# EAGLE design cwKeyer (EAGLE 6.6.0)

## Sheet 1 of 2
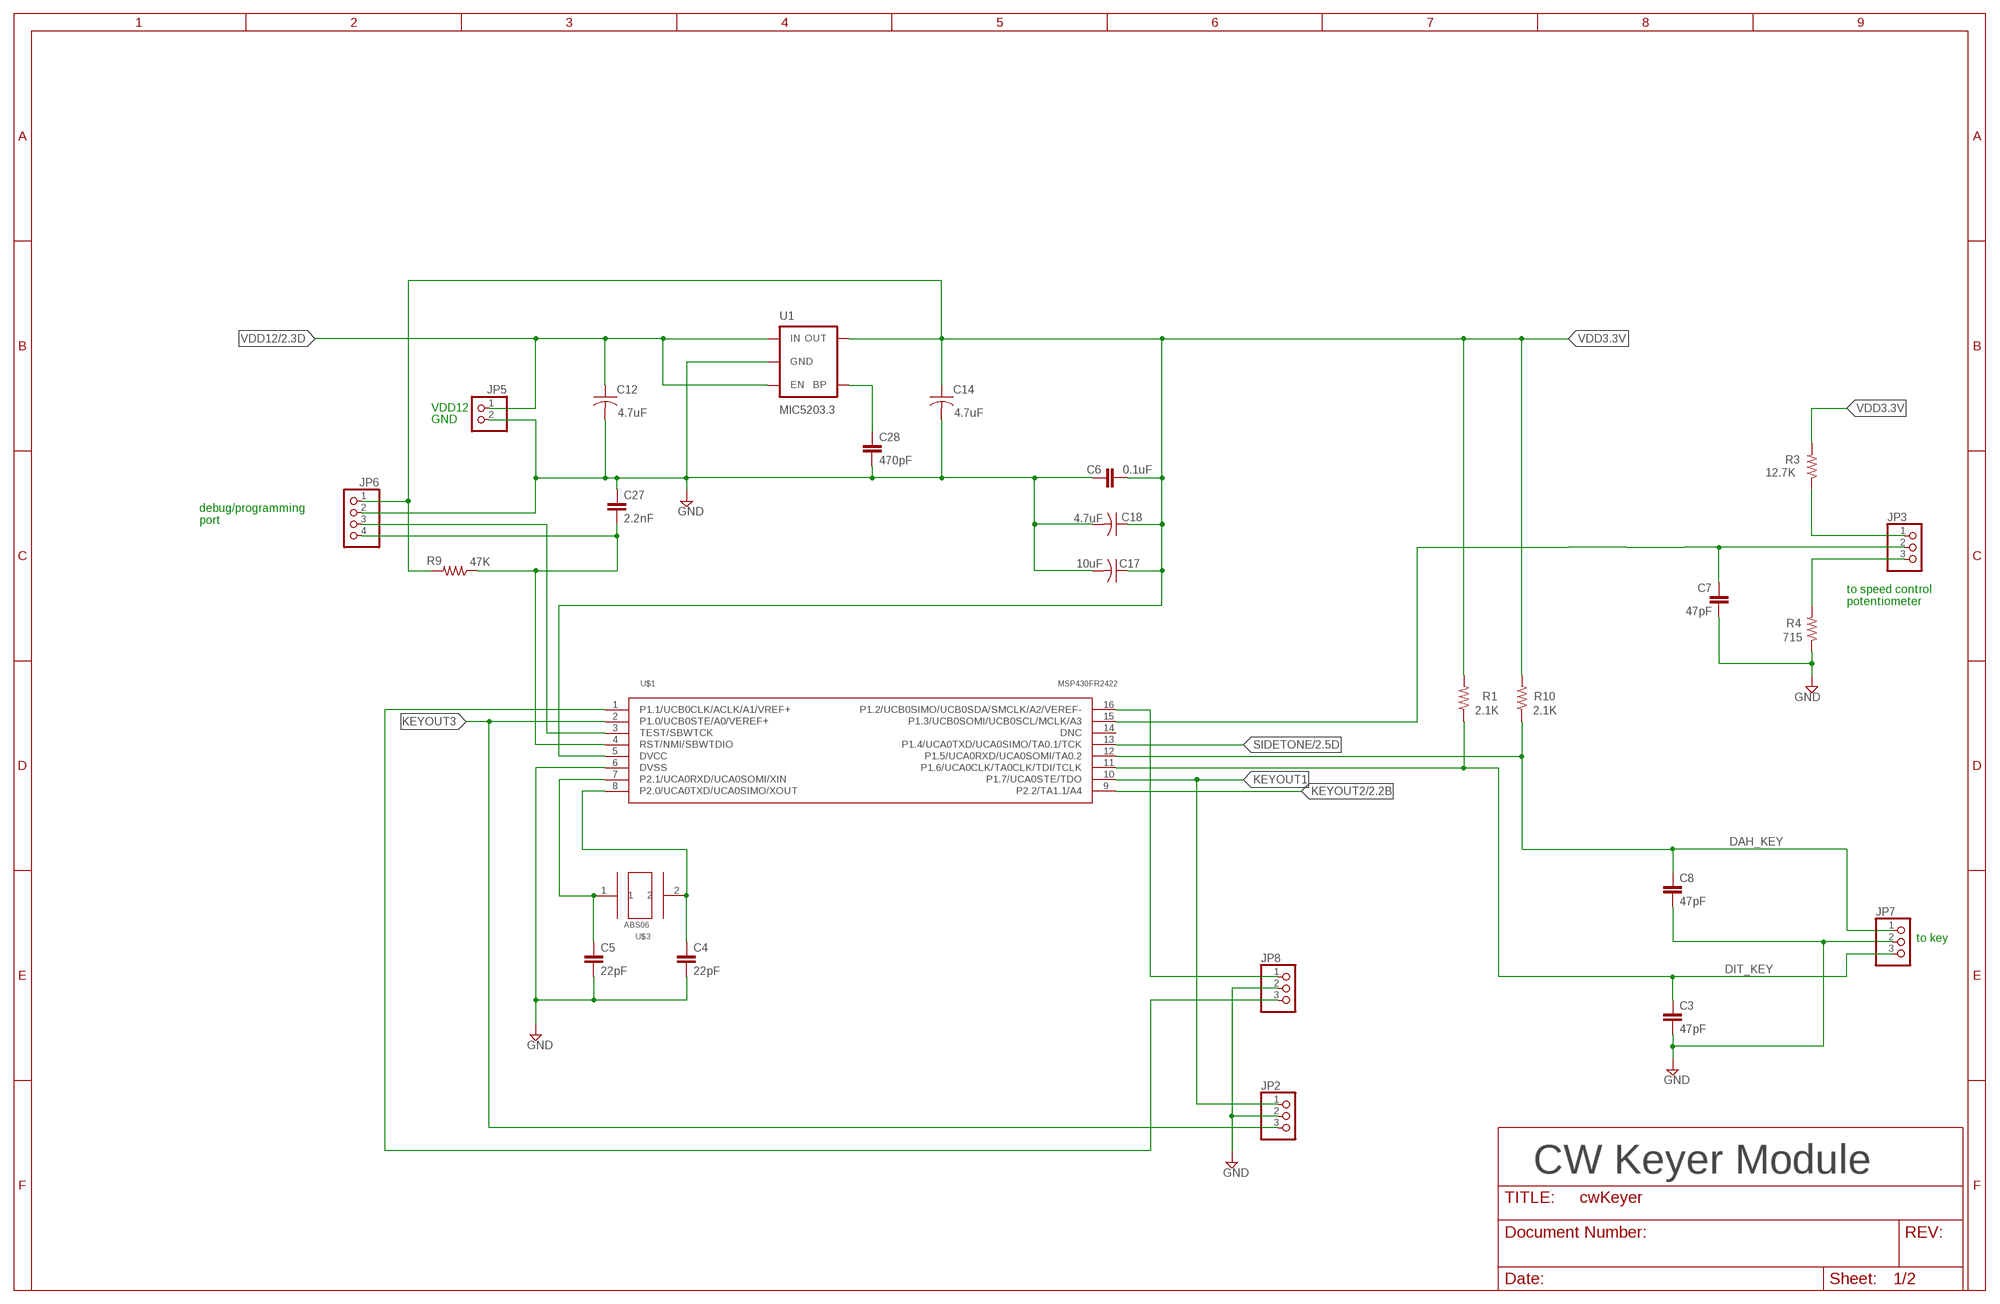
[diagram p0: schematic, sheet 1]

### Parts
C3  47pF  CAP0603-CAP  [0603-CAP]
C4  22pF  CAP0603-CAP  [0603-CAP]
C5  22pF  CAP0603-CAP  [0603-CAP]
C6  0.1uF  CAP0603-CAP  [0603-CAP]
C7  47pF  CAP0603-CAP  [0603-CAP]
C8  47pF  CAP0603-CAP  [0603-CAP]
C12  4.7uF  C-USC0603  [C0603]
C14  4.7uF  C-USC0603  [C0603]
C17  10uF  C-USC0805  [C0805]
C18  4.7uF  C-USC0603  [C0603]
C27  2.2nF  CAP0603-CAP  [0603-CAP]
C28  470pF  CAP0603-CAP  [0603-CAP]
JP2  PINHD-1X3  [1X03]
JP3  PINHD-1X3  [1X03]
JP5  PINHD-1X2  [1X02]
JP6  PINHD-1X4  [1X04]
JP7  PINHD-1X3  [1X03]
JP8  PINHD-1X3  [1X03]
R1  2.1K  RESISTOR0603-RES  [0603-RES]
R3  12.7K  RESISTOR0603-RES  [0603-RES]
R4  715  RESISTOR0603-RES  [0603-RES]
R9  47K  RESISTOR0603-RES  [0603-RES]
R10  2.1K  RESISTOR0603-RES  [0603-RES]
U1  MIC5203.3  MIC52053.3V  [SOT23-5]
U$1  MSP430FR2422  [TSSOP16]
U$3  ABS06  [ABS06]

### Nets
DAH_KEY: C8.1 JP7.1 R10.1 U$1.12(P1.5/UCA0RXD/UCA0SOMI/TA0.2)
DIT_KEY: C3.1 JP7.3 R1.1 U$1.11(P1.6/UCA0CLK/TA0CLK/TDI/TCLK)
GND: C3.2 C4.2 C5.2 C6.2 C7.2 C8.2 C12.2 C14.2 C17.2 C18.2 C27.1 C28.2 JP2.2 JP5.2 JP6.2 JP7.2 JP8.2 R4.1 U1.2(GND) U$1.6(DVSS) ; also sheet 2
KEYOUT1: JP2.1 U$1.10(P1.7/UCA0STE/TDO)
KEYOUT2: U$1.9(P2.2/TA1.1/A4) ; also sheet 2
KEYOUT3: JP2.3 U$1.2(P1.0/UCB0STE/A0/VEREF+)
N$2: C7.1 JP3.2 U$1.15(P1.3/UCB0SOMI/UCB0SCL/MCLK/A3)
N$5: C4.1 U$1.8(P2.0/UCA0TXD/UCA0SIMO/XOUT) U$3.2
N$8: JP3.3 R4.2
N$9: JP3.1 R3.1
N$14: C28.1 U1.4(BP)
N$23: JP6.3 U$1.3(TEST/SBWTCK)
N$31: C27.2 JP6.4 R9.1 U$1.4(RST/NMI/SBWTDIO)
N$32: C5.1 U$1.7(P2.1/UCA0RXD/UCA0SOMI/XIN) U$3.1
N$34: JP8.1 U$1.16(P1.2/UCB0SIMO/UCB0SDA/SMCLK/A2/VEREF-)
N$35: JP8.3 U$1.1(P1.1/UCB0CLK/ACLK/A1/VREF+)
SIDETONE: U$1.13(P1.4/UCA0TXD/UCA0SIMO/TA0.1/TCK) ; also sheet 2
VDD3.3V: C6.1 C14.1 C17.1 C18.1 JP6.1 R1.2 R3.2 R9.2 R10.2 U1.5(OUT) U$1.5(DVCC)
VDD12: C12.1 JP5.1 U1.1(IN) U1.3(EN) ; also sheet 2
Unconnected: U$1.14(DNC)

### Notes on the sheet
- VDD12
- GND
- debug/programming
  port
- to speed control
  potentiometer
- to key
- CW Keyer Module

## Sheet 2 of 2
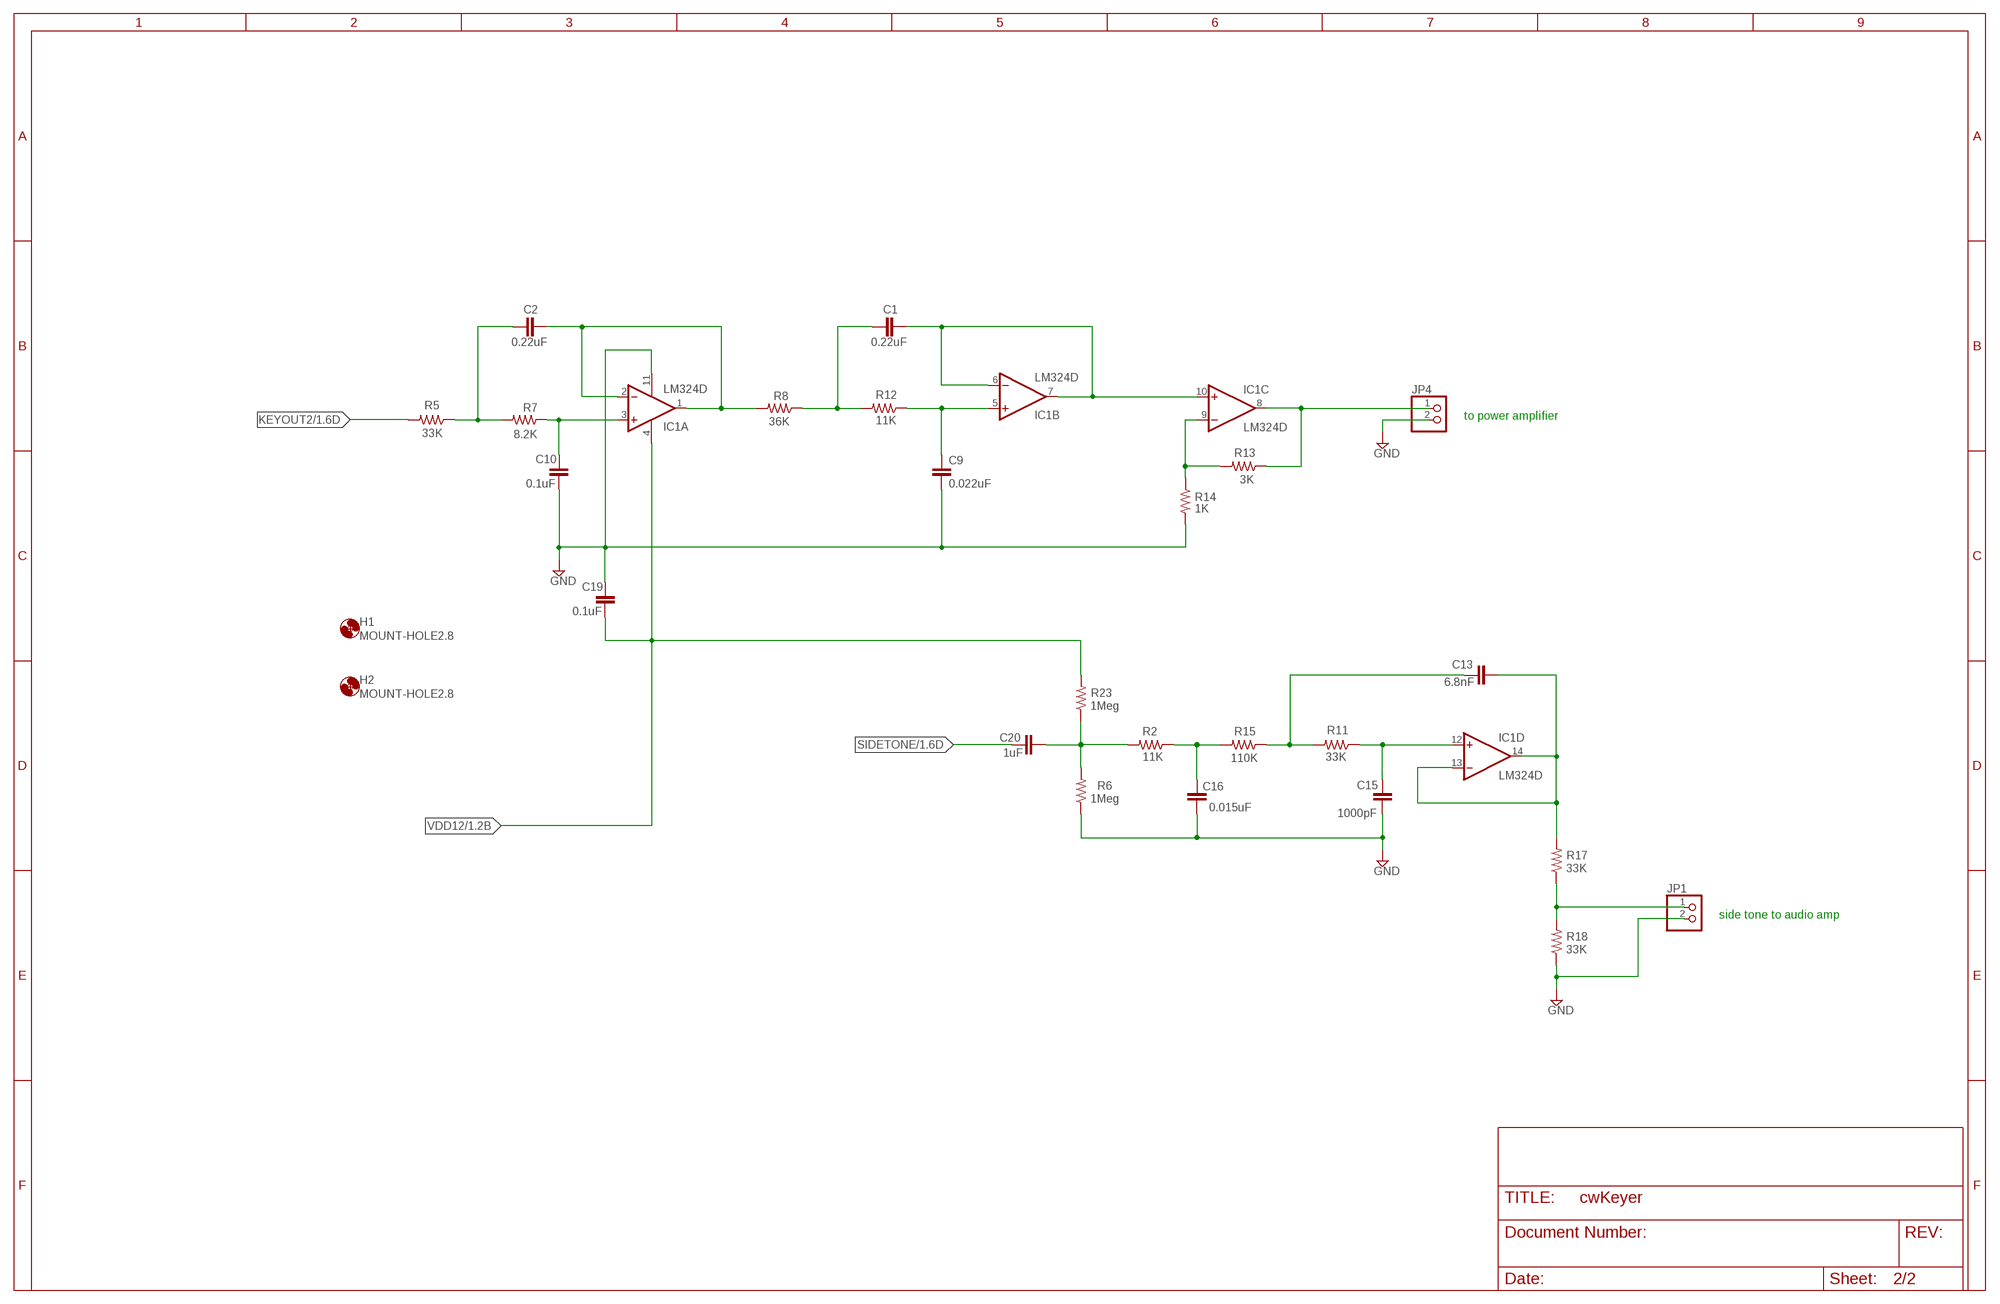
[diagram p1: schematic, sheet 2]

### Parts
C1  0.22uF  CAP0603-CAP  [0603-CAP]
C2  0.22uF  CAP0603-CAP  [0603-CAP]
C9  0.022uF  CAP0603-CAP  [0603-CAP]
C10  0.1uF  CAP0603-CAP  [0603-CAP]
C13  6.8nF  CAP0603-CAP  [0603-CAP]
C15  1000pF  CAP0603-CAP  [0603-CAP]
C16  0.015uF  CAP0603-CAP  [0603-CAP]
C19  0.1uF  CAP0603-CAP  [0603-CAP]
C20  1uF  CAP0603-CAP  [0603-CAP]
H1  MOUNT-HOLE2.8  [2,8]
H2  MOUNT-HOLE2.8  [2,8]
IC1  LM324D  [SO14]
JP1  PINHD-1X2  [1X02]
JP4  PINHD-1X2  [1X02]
R2  11K  RESISTOR0603-RES  [0603-RES]
R5  33K  RESISTOR0603-RES  [0603-RES]
R6  1Meg  RESISTOR0603-RES  [0603-RES]
R7  8.2K  RESISTOR0603-RES  [0603-RES]
R8  36K  RESISTOR0603-RES  [0603-RES]
R11  33K  RESISTOR0603-RES  [0603-RES]
R12  11K  RESISTOR0603-RES  [0603-RES]
R13  3K  RESISTOR0603-RES  [0603-RES]
R14  1K  RESISTOR0603-RES  [0603-RES]
R15  110K  RESISTOR0603-RES  [0603-RES]
R17  33K  RESISTOR0603-RES  [0603-RES]
R18  33K  RESISTOR0603-RES  [0603-RES]
R23  1Meg  RESISTOR0603-RES  [0603-RES]

### Nets
GND: C9.2 C10.2 C15.1 C16.1 C19.1 IC1.11(P:V-) JP1.2 JP4.2 R6.1 R14.2 R18.1 ; also sheet 1
KEYOUT2: R5.2 ; also sheet 1
N$6: JP1.1 R17.1 R18.2
N$7: IC1.8(C:OUT) JP4.1 R13.1
N$10: C13.2 IC1.13(D:-IN) IC1.14(D:OUT) R17.2
N$11: C20.2 R2.2 R6.2 R23.1
N$12: C10.1 IC1.3(A:+IN) R7.1
N$13: C2.1 R5.1 R7.2
N$15: C15.2 IC1.12(D:+IN) R11.1
N$16: C2.2 IC1.1(A:OUT) IC1.2(A:-IN) R8.2
N$17: C1.1 R8.1 R12.2
N$19: C9.1 IC1.5(B:+IN) R12.1
N$20: C13.1 R11.2 R15.1
N$21: C16.2 R2.1 R15.2
N$24: C1.2 IC1.6(B:-IN) IC1.7(B:OUT) IC1.10(C:+IN)
N$28: IC1.9(C:-IN) R13.2 R14.1
SIDETONE: C20.1 ; also sheet 1
VDD12: C19.2 IC1.4(P:V+) R23.2 ; also sheet 1

### Notes on the sheet
- to power amplifier
- side tone to audio amp

## Library data of the parts
C1 C2 = SparkFun-Passives:CAP: Capacitor Standard 0603 ceramic capacitor, and 0.1" leaded capacitor.; VENDOR: Mouser; VENDOR_PN: 710-885012206073
C3 C7 C8 = SparkFun-Passives:CAP: Capacitor Standard 0603 ceramic capacitor, and 0.1" leaded capacitor.; VENDOR: Mouser; VENDOR_PN: 603-CC603JRNPO9BN470
C4 C5 = SparkFun-Capacitors:CAP: Capacitor Standard 0603 ceramic capacitor, and 0.1" leaded capacitor.; VENDOR: Mouser; VENDOR_PN: 581-06035A220JAT4A
C6 C10 C19 = SparkFun-Passives:CAP: Capacitor Standard 0603 ceramic capacitor, and 0.1" leaded capacitor.; VENDOR: Mouser; VENDOR_PN: 710-885012206071
C9 = SparkFun-Passives:CAP: Capacitor Standard 0603 ceramic capacitor, and 0.1" leaded capacitor.; VENDOR: Mouser; VENDOR_PN: 80-C0603C223K3R
C12 C14 C17 C18 = rcl:C-US: CAPACITOR, American symbol
C13 = SparkFun-Passives:CAP: Capacitor Standard 0603 ceramic capacitor, and 0.1" leaded capacitor.; VENDOR: Mouser; VENDOR_PN: 603-CC603KRX7R8BB682
C15 = SparkFun-Passives:CAP: Capacitor Standard 0603 ceramic capacitor, and 0.1" leaded capacitor.; VENDOR: Mouser; VENDOR_PN: 710-885012206059
C16 = SparkFun-Passives:CAP: Capacitor Standard 0603 ceramic capacitor, and 0.1" leaded capacitor.; VENDOR: Mouser; VENDOR_PN: 710-885012206066
C20 = SparkFun-Passives:CAP: Capacitor Standard 0603 ceramic capacitor, and 0.1" leaded capacitor.; VENDOR: Mouser; VENDOR_PN: 710-885012106022
C27 = SparkFun-Passives:CAP: Capacitor Standard 0603 ceramic capacitor, and 0.1" leaded capacitor.; VENDOR: Mouser; VENDOR_PN: 603-CC0603JR8BB222
C28 = SparkFun-Capacitors:CAP: Capacitor Standard 0603 ceramic capacitor, and 0.1" leaded capacitor.; VENDOR: Mouser; VENDOR_PN: 603-CC0603JR7BB471
H1 H2 = holes:MOUNT-HOLE: MOUNTING HOLE with drill center marker
IC1 = myLibrary:LM324: OP AMP; VENDOR: Mouser; VENDOR_PN: 595-LM324DR
JP1 JP4 JP5 = pinhead:PINHD-1X2: PIN HEADER
JP2 JP3 JP7 JP8 = pinhead:PINHD-1X3: PIN HEADER
JP6 = pinhead:PINHD-1X4: PIN HEADER
R1 R10 = SparkFun-Passives:RESISTOR: Resistor Basic schematic elements and footprints for 0603, 1206, and PTH resistors.; VENDOR: Mouser; VENDOR_PN: 71-CRCW0603-2.1K-E3
R2 R12 = SparkFun-Passives:RESISTOR: Resistor Basic schematic elements and footprints for 0603, 1206, and PTH resistors.; VENDOR: Mouser; VENDOR_PN: 603-RC0603FR-0711KL
R3 = SparkFun-Passives:RESISTOR: Resistor Basic schematic elements and footprints for 0603, 1206, and PTH resistors.; VENDOR: Mouser; VENDOR_PN: 603-RC0603FR-0712K7L
R4 = SparkFun-Passives:RESISTOR: Resistor Basic schematic elements and footprints for 0603, 1206, and PTH resistors.; VENDOR: Mouser; VENDOR_PN: 603-RC0603FR-07715RL
R5 R11 R17 R18 = SparkFun-Passives:RESISTOR: Resistor Basic schematic elements and footprints for 0603, 1206, and PTH resistors.; VENDOR: Mouser; VENDOR_PN: 603-RC0603FR-0733KL
R6 R23 = SparkFun-Passives:RESISTOR: Resistor Basic schematic elements and footprints for 0603, 1206, and PTH resistors.; VENDOR: Mouser; VENDOR_PN: 603-RC0603FR-071ML
R7 = SparkFun-Passives:RESISTOR: Resistor Basic schematic elements and footprints for 0603, 1206, and PTH resistors.; VENDOR: Mouser; VENDOR_PN: 603-RC0603FR-078K2L
R8 = SparkFun-Passives:RESISTOR: Resistor Basic schematic elements and footprints for 0603, 1206, and PTH resistors.; VENDOR: Mouser; VENDOR_PN: 603-RC0603FR-0736KL
R9 = SparkFun-Passives:RESISTOR: Resistor Basic schematic elements and footprints for 0603, 1206, and PTH resistors.; VENDOR: Mouser; VENDOR_PN: 603-AC0603FR-1047KL
R13 = SparkFun-Passives:RESISTOR: Resistor Basic schematic elements and footprints for 0603, 1206, and PTH resistors.; VENDOR: Mouser; VENDOR_PN: 603-RC0603FR-073KL
R14 = SparkFun-Passives:RESISTOR: Resistor Basic schematic elements and footprints for 0603, 1206, and PTH resistors.; VENDOR: Mouser; VENDOR_PN: 603-RC0603FR-071KL
R15 = SparkFun-Passives:RESISTOR: Resistor Basic schematic elements and footprints for 0603, 1206, and PTH resistors.; VENDOR: Mouser; VENDOR_PN: 603-RC0603FR-07110KL
U1 = SparkFun-PowerIC:MIC5205: MIC5205 150mA vreg 3.3V - VREG-00822 5V - VREG-00823; PROD_ID: VREG-00822; VENDOR: Mouser; VENDOR_PN: 998-MIC5203-3.3YM5TR
U$1 = myLibrary:MSP430FR2422
U$3 = gew2018Library:ABS06: Abracon 32.768kHz Crystal; VENDOR: Mouser; VENDOR_PN: 815-ABS0612732.768KT

## Board
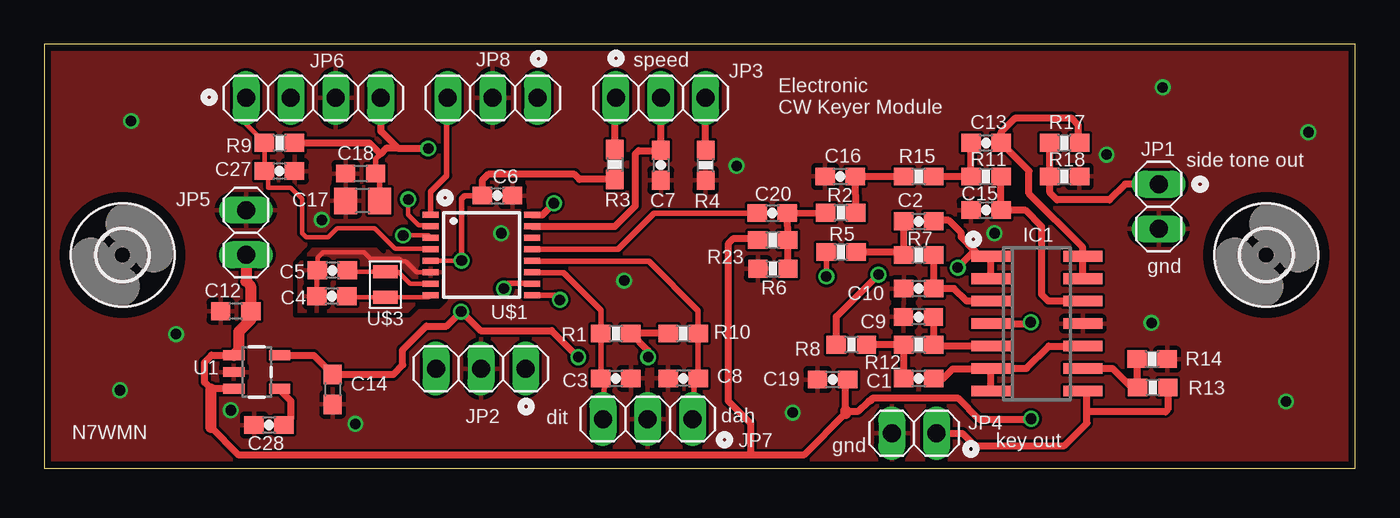
[diagram p2: board, top side]
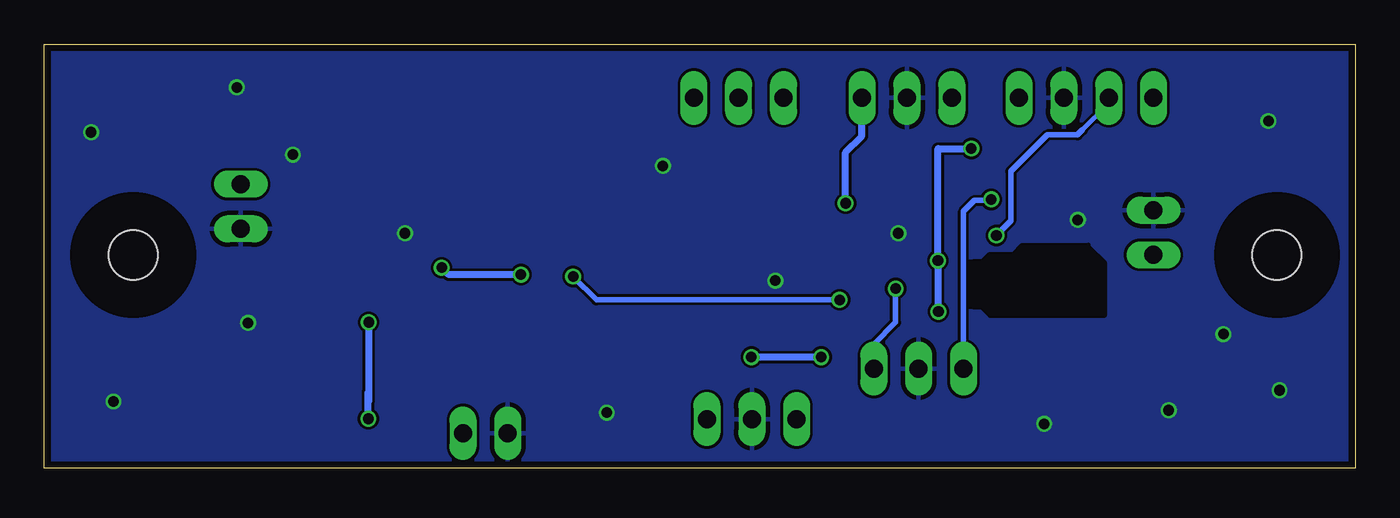
[diagram p3: board, bottom side, seen from below]

Size 74.26 x 24 mm. Coordinates in mm from the lower left corner, seen from the top.
Outline: 0,0 74.26,0 74.26,24 0,24 0,0
Copper layers (1*16): Top 0.035559375mm / dielectric 1.6mm / Bottom 0.035559375mm
Design rules "oshpark-2layer": minimum track width 6mil, minimum drill 10mil, track to track 6mil, track to pad 6mil, pad to pad 6mil, via to via 6mil, smd to smd 6mil, copper to edge 15mil, drill to drill 6mil, minimum pad ring 5mil, minimum via ring 5mil, stop-mask expansion 2.5mil, vias tented up to drill 0mil, thermal gap 10mil
tRestrict: 9 lines
bRestrict: 14 lines

### Footprints (pad centres in the part's own frame; a part is rotated, then mirrored left to right if it is on the bottom)
0603-CAP = smd 1.1 x 1: 1 -0.85,0; 2 0.85,0
C0603 = smd 1.1 x 1: 1 -0.85,0; 2 0.85,0
C0805 = smd 1.3 x 1.5: 1 -0.95,0; 2 0.95,0
2,8 = hole 2.8: 0,0
SO14 = smd 0.6 x 2.2: 1 -3.81,-2.6; 2 -2.54,-2.6; 3 -1.27,-2.6; 4 0,-2.6; 5 1.27,-2.6; 6 2.54,-2.6; 7 3.81,-2.6; 8 3.81,2.6; 9 2.54,2.6; 10 1.27,2.6; 11 0,2.6; 12 -1.27,2.6; 13 -2.54,2.6; 14 -3.81,2.6
1X02 = drill 1.016 long: 1 -1.27,0; 2 1.27,0
1X03 = drill 1.016 long: 1 -2.54,0; 2 0,0; 3 2.54,0
1X04 = drill 1.016 long: 1 -3.81,0; 2 -1.27,0; 3 1.27,0; 4 3.81,0
0603-RES = smd 1.1 x 1: 1 -0.85,0; 2 0.85,0
SOT23-5 = smd 0.55 x 1.2: 1 -0.95,-1.3; 2 0,-1.3; 3 0.95,-1.3; 4 0.95,1.3; 5 -0.95,1.3
TSSOP16 = smd 0.9 x 0.35: 1 -2.875,2.275; 2 -2.875,1.625; 3 -2.875,0.975; 4 -2.875,0.325; 5 -2.875,-0.325; 6 -2.875,-0.975; 7 -2.875,-1.625; 8 -2.875,-2.275; 9 2.875,-2.275; 10 2.875,-1.625; 11 2.875,-0.975; 12 2.875,-0.325; 13 2.875,0.325; 14 2.875,0.975; 15 2.875,1.625; 16 2.875,2.275
ABS06 = smd 0.75 x 1.4: 1 -0.725,0; 2 0.725,0

### Placement (x,y rotation side)
C1  49.53,5.08 0 top
C2  49.53,13.97 0 top
C3  32.38,5.08 0 top
C4  16.29,9.73 180 top
C5  16.33,11.2 180 top
C6  25.67,15.42 0 top
C7  34.92,17.14 270 top
C8  36.2,5.08 180 top
C9  49.51,8.56 180 top
C10  49.53,10.16 180 top
C12  10.85,8.88 180 top
C13  53.34,18.41 0 top
C14  16.34,4.46 270 top
C15  53.34,14.61 0 top
C16  45.09,16.51 0 top
C17  18.04,15.13 180 top
C18  17.92,16.68 180 top
C19  44.65,5.01 0 top
C20  41.24,14.43 0 top
C27  13.34,16.81 180 top
C28  12.74,2.44 180 top
H1  4.45,12.06 0 top
H2  69.22,12.06 0 top
IC1  56.23,8.18 270 top
JP1  63.13,14.81 270 top
JP2  24.73,5.63 180 top
JP3  34.92,20.95 0 top
JP4  49.27,1.97 180 top
JP5  11.43,13.34 90 top
JP6  15.24,20.95 180 top
JP7  34.18,2.78 180 top
JP8  25.4,20.95 180 top
R1  32.38,7.62 0 top
R2  45.12,14.46 180 top
R3  32.32,17.19 270 top
R4  37.47,17.14 90 top
R5  45.14,12.24 180 top
R6  41.28,11.29 0 top
R7  49.53,12.06 180 top
R8  45.72,6.99 180 top
R9  13.34,18.41 0 top
R10  36.2,7.62 180 top
R11  53.34,16.51 180 top
R12  49.53,6.99 180 top
R13  62.79,4.56 180 top
R14  62.75,6.17 0 top
R15  49.53,16.51 180 top
R17  57.78,18.41 0 top
R18  57.78,16.51 180 top
R23  41.26,12.92 180 top
U1  12.04,5.44 270 top
U$1  24.77,12.06 0 top
U$3  19.33,10.39 270 top

### Tracks (layer width: path | path; a pad name or v marks a point on that pad's centre or on a via)
DAH_KEY
  Top 0.305: JP7.1 36.83,4.87 C8.1 R10.1 37.05,8.92 34.26,11.7 27.68,11.7 U$1.12
DIT_KEY
  Top 0.305: JP7.3 31.75,4.87 C3.1 R1.1 31.54,8.94 29.41,11.06 27.67,11.06 U$1.11
GND  (via drill 0.6)
  Top 0.254: C4.2 15.44,11.16 C5.2 15.48,11.9 15.8,12.22 18.12,12.22 18.5,11.85 20.1,11.85 20.24,11.71 20.48,11.71 21.1,11.09 U$1.6
  other vias: 53.82,13.3 42.39,3.14 7.47,7.58 25.88,13.3 39.22,17.11 60.17,17.74 62.71,8.22 17.63,2.5 10.57,3.27 15.73,14.05 4.93,19.65 4.29,4.41 63.35,21.55 71.6,19.01 70.33,3.77 32.85,10.61
  pour Top: 0,0 0,24.13 74.3,24.13 74.3,0
  pour Bottom: 0,0 0,24.13 74.3,24.13 74.3,0
KEYOUT1  (via drill 0.6)
  Top 0.305: 26.04,10.21 26.28,10.46 27.62,10.46 U$1.10
  Top 0.406: v26.04,10.16 26.04,10.21
  Bottom 0.305: JP2.1 27.27,7.01 26.04,8.26 v26.04,10.16
KEYOUT2  (via drill 0.6)
  Top 0.305: U$1.9 28.95,9.79 v29.21,9.53 | v44.3,10.85 44.3,12.22 R5.2
  Bottom 0.305: v29.21,9.53 42.98,9.53 v44.3,10.85
KEYOUT3  (via drill 0.6)
  Top 0.254: v20.62,15.21 20.62,14.33 21.21,13.74 21.84,13.74 U$1.2
  Bottom 0.305: JP2.3 22.2,14.53 21.57,15.16 20.67,15.16 v20.62,15.21
N$2
  Top 0.406: JP3.2 C7.1 34.9,17.96 33.67,17.96 33.49,17.79 33.49,14.85 32.33,13.69 U$1.15
N$5
  Top 0.254: U$1.8 21.77,9.66 U$3.2 17.2,9.66 C4.1
N$6
  Top 0.406: R17.1 R18.2 56.96,16.48 56.96,15.59 57.36,15.18 60.33,15.18 61.23,16.08 JP1.1
N$7
  Top 0.406: JP4.1 52,1.97 52.7,1.27 57.78,1.27 59.05,2.54 59.05,3.17 | 59.05,3.17 59.05,4.14 IC1.8 | R13.1 63.64,3.31 63.5,3.17 59.05,3.17
N$8
  Top 0.406: R4.2 JP3.3
N$9
  Top 0.406: R3.1 32.32,20.89 JP3.1
N$10
  Top 0.406: IC1.13 IC1.14 58.83,12.5 55.78,15.54 55.78,16.82 C13.2 54.19,19.01 55.01,19.82 58.17,19.82 58.56,19.43 58.56,18.49 R17.2
N$11
  Top 0.406: R6.2 R23.1 C20.2 R2.2
N$12
  Top 0.406: IC1.3 52.25,9.45 51.53,10.16 C10.1 | C10.1 | C10.1 R7.1
N$13
  Top 0.406: R5.1 48.51,12.24 R7.2 C2.1
N$14
  Top 0.406: U1.4 13.35,4.43 13.97,3.81 13.97,2.82 C28.1
N$15
  Top 0.406: IC1.12 56.86,9.45 56.5,9.81 56.5,13.68 55.59,14.59 54.21,14.59 C15.2 R11.1
N$16  (via drill 0.6)
  Top 0.406: IC1.2 IC1.1 53.03,11.99 52.7,12.32 | 52.7,12.32 51.94,13.08 51.94,13.32 51.23,14.02 50.43,14.02 C2.2 | R8.2 44.87,8.57 v47.25,10.95 | v51.75,11.35 51.75,11.37 52.7,12.32
  Bottom 0.406: v47.25,10.95 51.35,10.95 v51.75,11.35
N$17
  Top 0.406: C1.1 R12.2 R8.1
N$19
  Top 0.406: IC1.5 50.45,6.91 R12.1 50.38,8.55 C9.1
N$20
  Top 0.406: R15.1 R11.2 C13.1
N$21
  Top 0.406: R2.1 C16.2 R15.2
N$23  (via drill 0.6)
  Top 0.254: v20.33,13.17 21.76,13.17 U$1.3
  Bottom 0.254: JP6.3 13.97,20.63 15.45,19.15
  Bottom 0.305: 15.45,19.15 15.73,18.87 17.44,18.87 19.51,16.79 19.51,13.99 v20.33,13.17
N$24
  Top 0.406: IC1.7 IC1.6 | C1.2 50.92,5.08 51.46,5.62 53.6,5.62 IC1.6 | IC1.6 55.63,5.64 56.9,6.91 IC1.10
N$28
  Top 0.406: R14.1 61.9,4.6 R13.2 61.59,4.56 60.53,5.62 58.84,5.62 IC1.9
N$31
  Top 0.254: JP6.4 11.43,19.47 R9.1 C27.2 12.7,16.59 12.7,15.88 13.97,15.88 14.61,15.24 14.61,13.3 14.84,13.07 16.08,13.07 16.59,13.57 18.72,13.57 19.88,12.41 21.87,12.41 U$1.4
N$32
  Top 0.254: U$1.7 20.73,10.43 20.05,11.12 U$3.1 17.26,11.12 C5.1
N$34  (via drill 0.6)
  Top 0.406: U$1.16 28.22,14.34 v28.87,14.99
  Bottom 0.406: v28.87,14.99 28.87,17.87 27.95,18.79 JP8.1
N$35
  Top 0.305: U$1.1 21.89,15.64 22.8,16.56 22.8,20.9 JP8.3
SIDETONE
  Top 0.305: U$1.13 32.5,12.39 34.54,14.43 C20.1
VDD3.3V  (via drill 0.6)
  Top 0.254: U$1.5 v23.64,11.74 | 19.08,20.93 JP6.1 | 16.35,5.3 C14.1
  Top 0.305: C17.1 18.99,16.46 C18.1 18.77,17.5 19.05,17.78 | C6.1 23.82,15.42 23.64,15.24 v23.64,11.74
  Top 0.406: U1.5 15.26,6.39 C14.1 | 20.05,18.09 19.08,19.07 19.08,20.93 | 20.05,18.09 19.36,18.09 19.05,17.78 18.41,18.41 R9.2 | 16.35,5.3 19.76,5.3 20.32,5.85 20.32,6.71 21.64,8.04 22.79,8.04 v23.61,8.86 23.64,8.86 24.72,7.79 28.75,7.79 v30.25,6.28 | v21.75,18.09 20.05,18.09 | R3.2 30.32,16.34 30.03,16.62 25.15,16.62 24.81,16.28 24.81,15.43 C6.1 | v34.21,6.28 34.21,6.65 R1.2 R10.2
  Bottom 0.254: 23.64,18.08 23.63,18.09 | 23.64,8.89 v23.61,8.86
  Bottom 0.406: 23.64,8.89 v23.64,11.74 23.64,18.08 v21.76,18.08 v21.75,18.09 | v30.25,6.28 v34.21,6.28
VDD12  (via drill 0.6)
  Top 0.406: U1.3 9.45,4.49 9.08,4.86 9.08,5.99 9.49,6.39 U1.1 | IC1.4 55.8,8.18 v55.88,8.26 | C19.2 45.39,4.91 45.39,3.22 46.12,3.22 46.7,3.79 46.77,3.79 46.95,3.97 51.75,3.97 52.95,2.77 55.88,2.77 v55.9,2.79 | R23.2 40.36,12.97 39.01,12.97 38.73,12.7 38.73,3.81 40.01,2.54 40.01,0.73 | 45.39,3.1 43.03,0.73 40.01,0.73 | 40.01,0.73 11.02,0.73 9.45,2.3
  Top 0.61: JP5.1 11.43,10.56 11.69,10.3 C12.1 11.7,8.41 11.02,7.73 11.02,6.66 U1.1 | 45.39,3.22 45.39,3.1 | 9.45,2.3 9.45,4.48 9.45,4.49
  Bottom 0.406: v55.88,8.26 55.88,4.33 | 55.88,4.33 55.88,3.81 | v55.9,2.79 55.9,4.31 55.88,4.33

### Text on the board
tPlace: speed | Electronic / CW Keyer Module | side tone out | gnd | dah | N7WMN | dit | gnd | key out